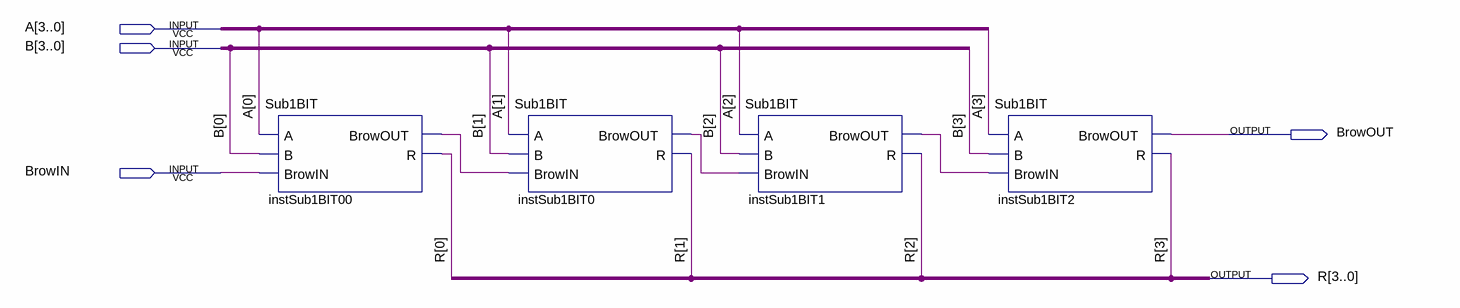
[diagram p0: schematic sheet]
// Quartus schematic Sub4BIT.bdf as structural Verilog: 4 symbols, 5 pins
module Sub4BIT (
  input  [3:0] A,
  input  [3:0] B,
  input  BrowIN,
  output BrowOUT,
  output [3:0] R
);

  wire instSub1BIT00_browout, instSub1BIT0_browout, instSub1BIT1_browout;

  Sub1BIT instSub1BIT00 (.A(A[0]), .B(B[0]), .BrowIN(BrowIN), .BrowOUT(instSub1BIT00_browout), .R(R[0]));
  Sub1BIT instSub1BIT0 (.A(A[1]), .B(B[1]), .BrowIN(instSub1BIT00_browout), .BrowOUT(instSub1BIT0_browout), .R(R[1]));
  Sub1BIT instSub1BIT1 (.A(A[2]), .B(B[2]), .BrowIN(instSub1BIT0_browout), .BrowOUT(instSub1BIT1_browout), .R(R[2]));
  Sub1BIT instSub1BIT2 (.A(A[3]), .B(B[3]), .BrowIN(instSub1BIT1_browout), .BrowOUT(BrowOUT), .R(R[3]));
endmodule
